# EAGLE design Project2 (EAGLE 9.2.2)
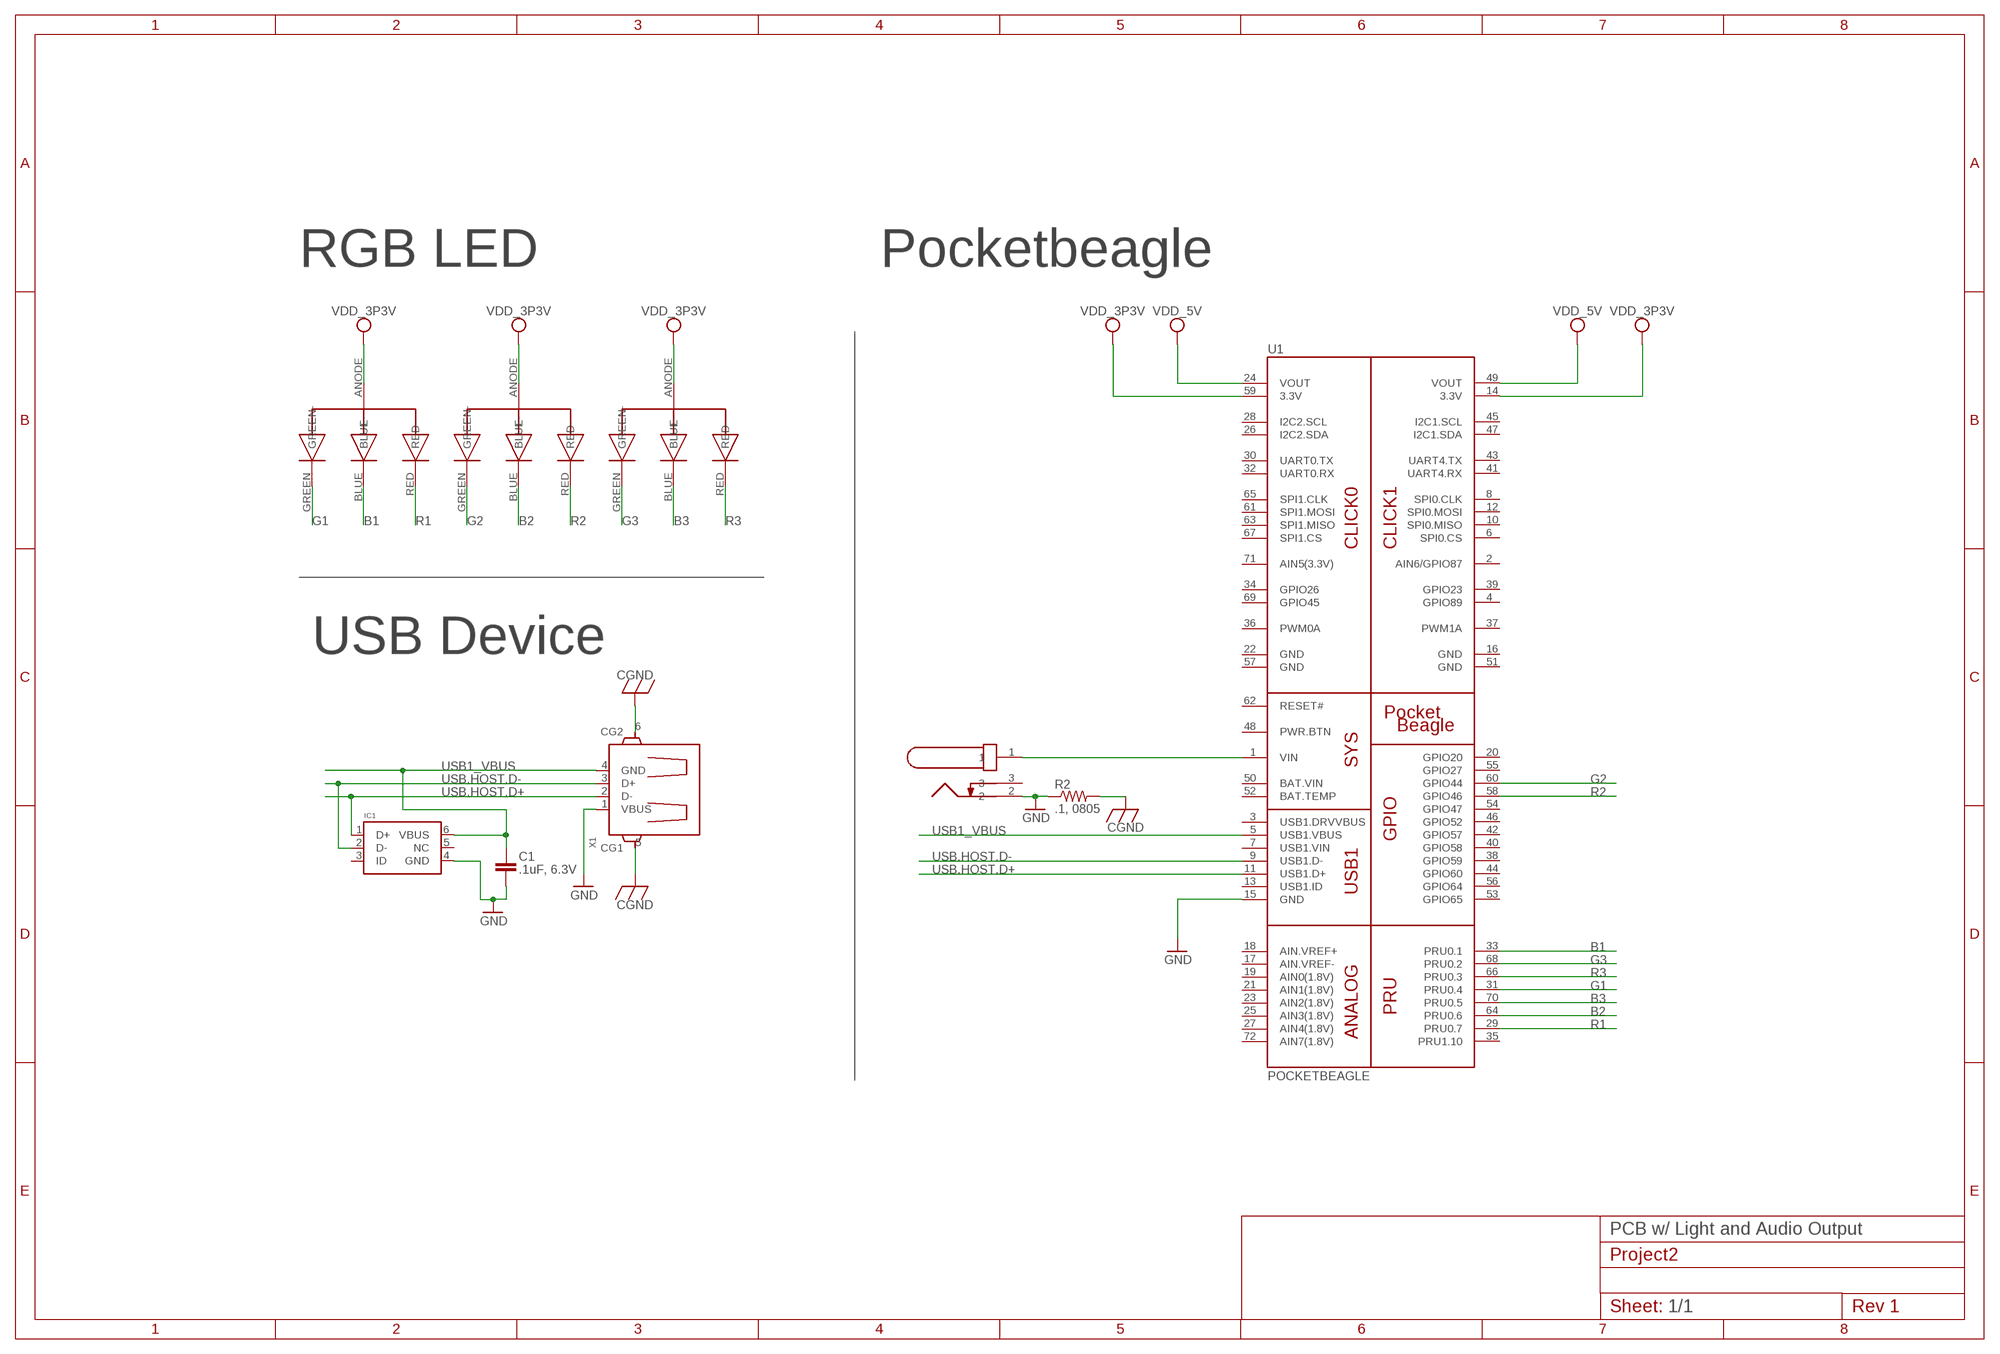
[diagram p0: schematic, sheet 1]

## Parts
C1  .1uF, 6.3V  C_C0402  [C0402]
IC1  DRY  [SON-6(TI)-DRY]
R2  .1, 0805  RCL_R-US_R0805  [RCL_R0805]
U1  POCKETBEAGLE  [POCKETBEAGLE]
U$1  RGBLED-LX0404  [SML-LX0404SIUPGUSB]
U$2  PJ-202  [PJ-202A]
U$3  RGBLED-LX0404  [SML-LX0404SIUPGUSB]
U$4  RGBLED-LX0404  [SML-LX0404SIUPGUSB]
X1  USB_HOST  [USB_HOST]

## Nets
B1: U1.33(PRU0.1) U$1.BLUE(BLUE-)
B2: U1.64(PRU0.6) U$3.BLUE(BLUE-)
B3: U1.70(PRU0.5) U$4.BLUE(BLUE-)
CGND: R2.2 X1.5(CG1) X1.6(CG2)
G1: U1.31(PRU0.4) U$1.GREEN(GREEN-)
G2: U1.60(GPIO44) U$3.GREEN(GREEN-)
G3: U1.68(PRU0.2) U$4.GREEN(GREEN-)
GND: C1.2 IC1.4(GND) R2.1 U1.15(GND) U$2.2 X1.1(VBUS)
N$1: U1.1(VIN) U$2.1
R1: U1.29(PRU0.7) U$1.RED(RED-)
R2: U1.58(GPIO46) U$3.RED(RED-)
R3: U1.66(PRU0.3) U$4.RED(RED-)
USB1_VBUS: C1.1 IC1.6(VBUS) U1.5(USB1.VBUS) X1.4(GND)
USB.HOST.D+: IC1.1(D+) U1.11(USB1.D+) X1.2(D-)
USB.HOST.D-: IC1.2(D-) U1.9(USB1.D-) X1.3(D+)
VDD_3P3V: U1.14(3.3V) U1.59(3.3V) U$1.ANODE(+) U$3.ANODE(+) U$4.ANODE(+)
VDD_5V: U1.24(VOUT) U1.49(VOUT)
Unconnected: IC1.3(ID) IC1.5(NC) U1.2(AIN6/GPIO87) U1.3(USB1.DRVVBUS) U1.4(GPIO89) U1.6(SPI0.CS) U1.7(USB1.VIN) U1.8(SPI0.CLK) U1.10(SPI0.MISO) U1.12(SPI0.MOSI) U1.13(USB1.ID) U1.17(AIN.VREF-) U1.18(AIN.VREF+) U1.19(AIN0(1.8V)) U1.20(GPIO20) U1.21(AIN1(1.8V)) U1.23(AIN2(1.8V)) U1.25(AIN3(1.8V)) U1.26(I2C2.SDA) U1.27(AIN4(1.8V)) U1.28(I2C2.SCL) U1.30(UART0.TX) U1.32(UART0.RX) U1.34(GPIO26) U1.35(PRU1.10) U1.36(PWM0A) U1.37(PWM1A) U1.38(GPIO59) U1.39(GPIO23) U1.40(GPIO58) U1.41(UART4.RX) U1.42(GPIO57) U1.43(UART4.TX) U1.44(GPIO60) U1.45(I2C1.SCL) U1.46(GPIO52) U1.47(I2C1.SDA) U1.48(PWR.BTN) U1.52(BAT.TEMP) U1.53(GPIO65) U1.54(GPIO47) U1.55(GPIO27) U1.56(GPIO64) U1.61(SPI1.MOSI) U1.62(RESET#) U1.63(SPI1.MISO) U1.65(SPI1.CLK) U1.67(SPI1.CS) U1.69(GPIO45) U1.71(AIN5(3.3V)) U1.72(AIN7(1.8V)) U$2.3

## Notes on the sheet
- RGB LED | Pocketbeagle
- USB Device
- PCB w/ Light and Audio Output
- 1/1

## Power pins joined to a net without a drawn wire
BAT.VIN: U1.50(BAT.VIN)
GND: U1.16(GND) U1.22(GND) U1.51(GND) U1.57(GND)

## Library data of the parts
C1 = Project2:C_: Capacitor SMD. Sizes: 0402, 0603 & 0805
IC1 = Project2:DRY
R2 = Project2:RCL_R-US_: RESISTOR, American symbol
U1 = Project2:POCKETBEAGLE
U$1 U$3 U$4 = Project2:RGBLED-LX0404
U$2 = Project2:PJ-202
X1 = Project2:USB_HOST

## Board
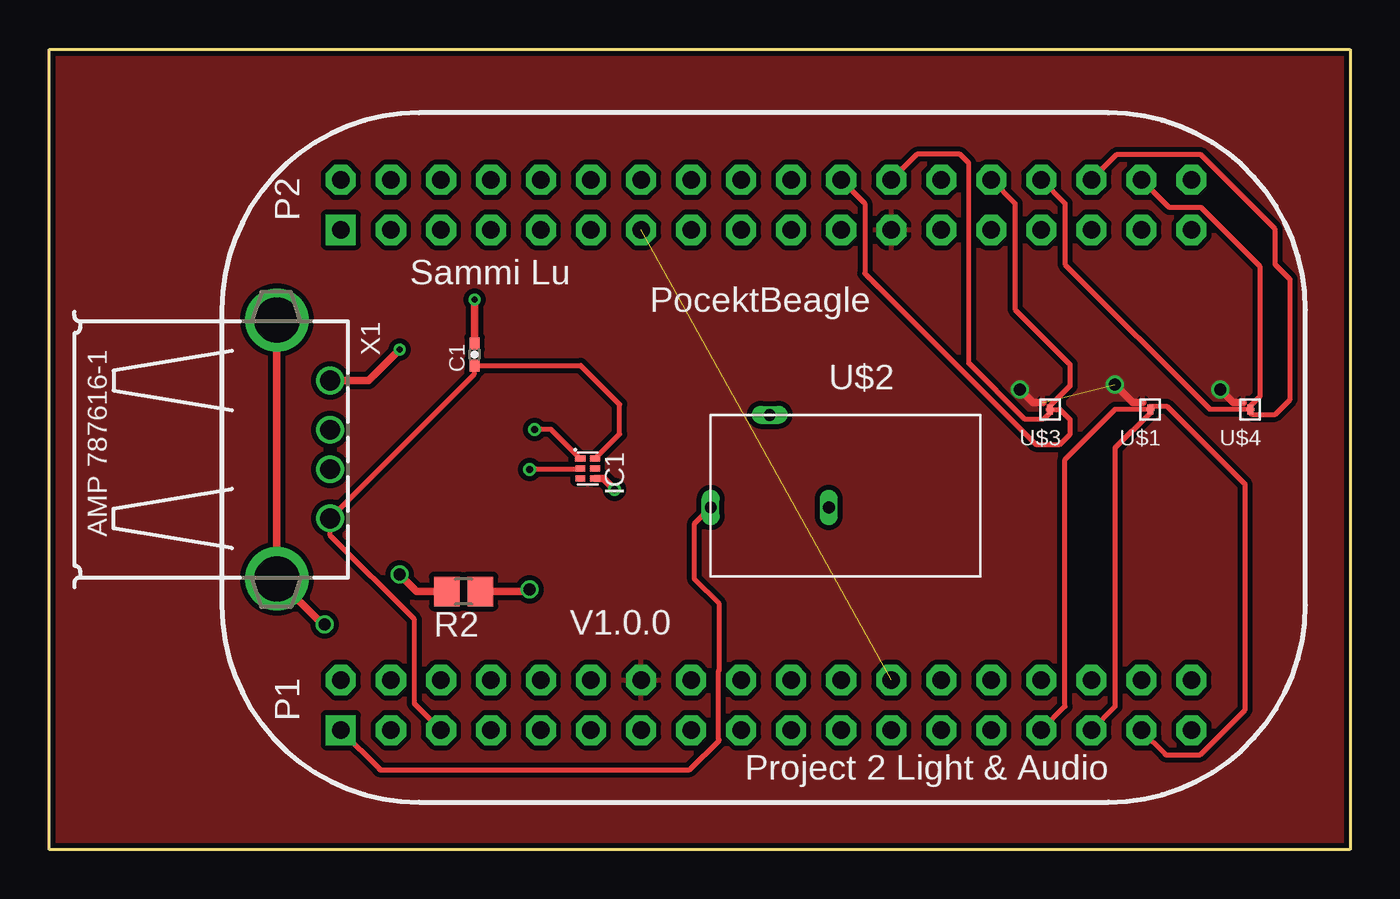
[diagram p1: board, top side]
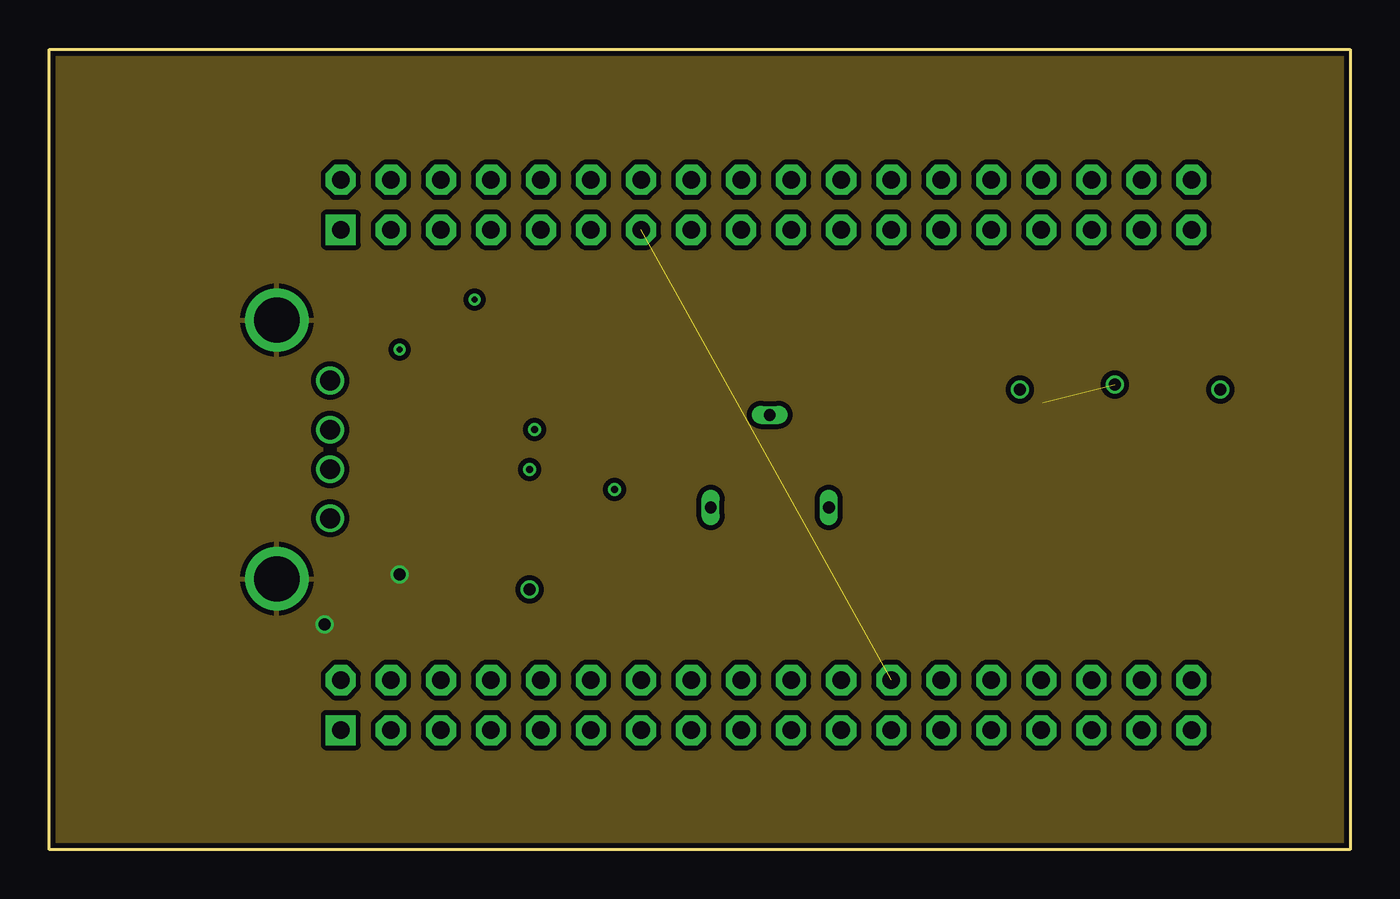
[diagram p2: board, inner layer Route15]
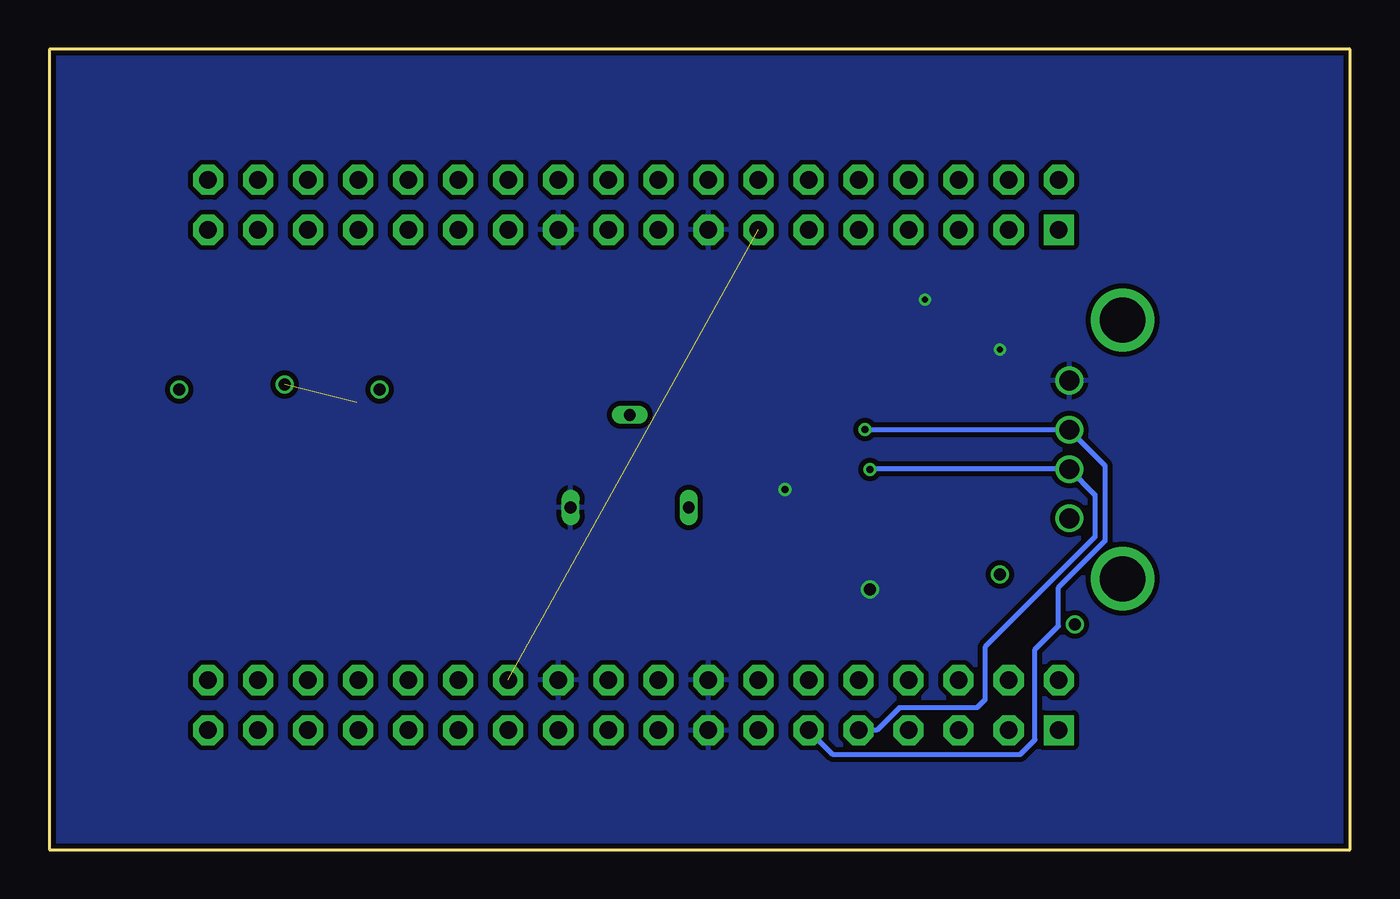
[diagram p3: board, bottom side, seen from below]

Size 66.04 x 40.64 mm. Coordinates in mm from the lower left corner, seen from the top.
Outline: 0,0 0,40.64 66.04,40.64 66.04,0 0,0
Copper layers (1*2*15*16): Top 0.035mm / dielectric 0.23mm / Route2 0.035mm / dielectric 0.93mm / Route15 0.035mm / dielectric 0.23mm / Bottom 0.035mm
Design rules "ENGI301_4lyr": minimum track width 10mil, minimum drill 12mil, track to track 10mil, track to pad 10mil, pad to pad 10mil, via to via 10mil, smd to smd 10mil, copper to edge 10mil, drill to drill 12mil, minimum pad ring 6mil, minimum via ring 6mil, stop-mask expansion 3mil, vias tented up to drill 25mil, thermal gap 10mil

### Footprints (pad centres in the part's own frame; a part is rotated, then mirrored left to right if it is on the bottom)
C0402 = smd 0.61 x 0.508: 1 -0.559,0; 2 0.559,0
SON-6(TI)-DRY = smd 0.3 x 0.52: 1 -0.5,-0.38 | smd 0.3 x 0.49: 2 0,-0.375; 3 0.5,-0.375; 4 0.5,0.375; 5 0,0.375; 6 -0.5,0.375
RCL_R0805 = smd 1.3 x 1.5: 1 -0.85,0; 2 0.85,0
POCKETBEAGLE = drill 0.889 pad 1.524 square: 1 5.91,3.53; 37 5.91,28.93 | drill 0.889 pad 1.524 octagon: 2 5.91,6.07; 3 8.45,3.53; 4 8.45,6.07; 5 10.99,3.53; 6 10.99,6.07; 7 13.53,3.53; 8 13.53,6.07; 9 16.07,3.53; 10 16.07,6.07; 11 18.61,3.53; 12 18.61,6.07; 13 21.15,3.53; 14 21.15,6.07; 15 23.69,3.53; 16 23.69,6.07; 17 26.23,3.53; 18 26.23,6.07; 19 28.77,3.53; 20 28.77,6.07; 21 31.31,3.53; 22 31.31,6.07; 23 33.85,3.53; 24 33.85,6.07; 25 36.39,3.53; 26 36.39,6.07; 27 38.93,3.53; 28 38.93,6.07; 29 41.47,3.53; 30 41.47,6.07; 31 44.01,3.53; 32 44.01,6.07; 33 46.55,3.53; 34 46.55,6.07; 35 49.09,3.53; 36 49.09,6.07; 38 5.91,31.47; 39 8.45,28.93; 40 8.45,31.47; 41 10.99,28.93; 42 10.99,31.47; 43 13.53,28.93; 44 13.53,31.47; 45 16.07,28.93; 46 16.07,31.47; 47 18.61,28.93; 48 18.61,31.47; 49 21.15,28.93; 50 21.15,31.47; 51 23.69,28.93; 52 23.69,31.47; 53 26.23,28.93; 54 26.23,31.47; 55 28.77,28.93; 56 28.77,31.47; 57 31.31,28.93; 58 31.31,31.47; 59 33.85,28.93; 60 33.85,31.47; 61 36.39,28.93; 62 36.39,31.47; 63 38.93,28.93; 64 38.93,31.47; 65 41.47,28.93; 66 41.47,31.47; 67 44.01,28.93; 68 44.01,31.47; 69 46.55,28.93; 70 46.55,31.47; 71 49.09,28.93; 72 49.09,31.47
SML-LX0404SIUPGUSB = smd 0.152 x 0.152: ANODE 0.36,-0.36 | smd 0.305 x 0.152: BLUE 0,-0.17; GREEN 0,0.17 | smd 0.406 x 0.152: RED 0,0
PJ-202A = drill 0.6 long: 1 -3,0; 2 3,0; 3 0,4.7
USB_HOST = drill 1: 1 -3.5,12.99; 2 -1,12.99; 3 1,12.99; 4 3.5,12.99 | drill 2.3: 5 -6.57,10.28; 6 6.57,10.28

### Placement (x,y rotation side)
C1  21.59,25.15 90 top
IC1  27.33,19.35 270 top
R2  21.03,13.11 180 top
U1  8.89,2.54 0 top
U$1  55.88,22.35 180 top
U$2  36.58,17.37 0 top
U$3  50.8,22.35 180 top
U$4  60.96,22.35 180 top
X1  1.27,20.32 270 top

### Tracks (layer width: path | path; a pad name or v marks a point on that pad's centre or on a via)
B1
  Top 0.254: U$1.BLUE 56.73,22.52 60.71,18.54 60.71,7.11 58.42,4.83 56.64,4.83 56.64,4.87 U1.33
B2
  Top 0.254: U1.64 49.02,32.81 49.02,27.43 51.82,24.64 51.82,23.62 51.82,23.54 U$3.BLUE
B3
  Top 0.254: U1.70 56.84,32.61 58.45,32.61 61.47,29.6 61.47,23.03 U$4.BLUE
CGND  (via drill 0.61)
  Top 0.381: X1.5 X1.6 13.87,11.43 v13.97,11.43 | R2.2 18.64,13.11 v17.78,13.97
  pour Route15: 0,40.64 0,0 66.04,0 66.04,40.64
G1
  Top 0.254: U$1.GREEN 54.1,20.4 54.1,7.27 U1.31
G2
  Top 0.254: U1.60 44.04,35.31 46.23,35.31 46.68,34.86 46.68,24.7 49.53,21.84 50.46,21.84 U$3.GREEN
G3
  Top 0.254: U1.68 54.2,35.31 58.42,35.31 62.23,31.5 62.23,29.72 62.99,28.96 62.99,22.86 62.23,22.1 61.04,22.1 U$4.GREEN
GND  (via drill 0.3, 0.35, 0.61)
  Top 0.381: X1.1 16.2,23.82 v17.78,25.4 | C1.2 v21.59,27.94 | IC1.4 28.14,18.86 v28.7,18.29 | R2.1 24.28,13.11 v24.38,13.21
  pour Bottom: 0,40.64 0,0 66.04,0 66.04,40.64
N$1
  Top 0.254: U1.1 16.76,4.11 16.76,4.06 32.51,4.06 34.01,5.56 33.98,5.6 33.98,9.08 34.01,9.12 34.01,12.47 32.77,13.72 32.77,16.56 U$2.1
R1
  Top 0.254: U1.29 51.56,7.27 51.56,19.81 54.1,22.35 U$1.RED
R2
  Top 0.254: U$3.RED 51.31,22.35 51.82,21.84 51.82,21.08 51.31,20.57 50.08,20.57 41.4,29.25 41.4,32.81 U1.58
R3
  Top 0.254: U$4.RED 58.93,22.35 51.56,29.72 51.56,32.81 U1.66
USB1_VBUS
  Top 0.254: U1.5 18.54,7.41 18.54,11.68 14.26,15.97 X1.4 21.59,24.15 C1.1 26.98,24.59 28.96,22.61 28.96,21.08 28.93,21.08 IC1.6
USB.HOST.D+  (via drill 0.35)
  Top 0.254: v24.64,21.34 25.47,21.34 IC1.1
  Bottom 0.254: v24.64,21.34 24.62,21.32 X1.2 12.45,19.51 12.45,15.67 14.81,13.31 14.81,11.35 16,10.16 16,5.59 16.76,4.83 26.26,4.83 U1.11
USB.HOST.D-  (via drill 0.35)
  Top 0.254: IC1.2 26.91,19.3 v24.38,19.3
  Bottom 0.254: v24.38,19.3 24.37,19.32 X1.3 12.95,18.01 12.95,15.88 18.54,10.29 18.54,7.62 18.95,7.21 22.89,7.21 24.04,6.07 U1.9
VDD_3P3V  (via drill 0.61)  (1 unrouted)
  Top 0.381: U$4.ANODE 60.09,22.71 v59.44,23.37 | U$3.ANODE 49.93,22.71 v49.28,23.37 | U$1.ANODE 55.01,22.71 v54.1,23.62
  pour Top: 0,40.64 0,0 66.04,0 66.04,40.64
VDD_5V  (1 unrouted)

### Text on the board
tNames: Sammi Lu | V1.0.0 | Project 2 Light & Audio